# EAGLE design TicTacToe (EAGLE 9.6.2)

## Sheet 1 of 3
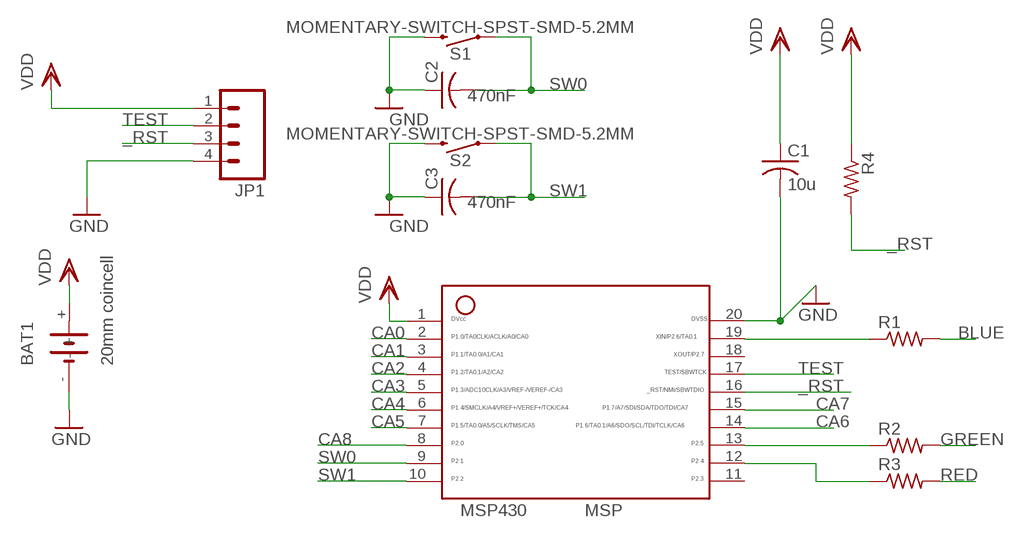
[diagram p0: schematic, sheet 1]

### Parts
BAT1  20mm coincell  1060TR  [BAT_1060TR]
C1  10u  C-USC1206  [C1206]
C2  470nF  C-USC0805  [C0805]
C3  470nF  C-USC0805  [C0805]
JP1  M04LOCK  [1X04_LOCK]
MSP430  MSP  MSP430  [20_PIN]
R1  R-US_R0805  [R0805]
R2  R-US_R0805  [R0805]
R3  R-US_R0805  [R0805]
R4  R-US_R0805  [R0805]
S1  MOMENTARY-SWITCH-SPST-SMD-5.2MM  [TACTILE_SWITCH_SMD_5.2MM]
S2  MOMENTARY-SWITCH-SPST-SMD-5.2MM  [TACTILE_SWITCH_SMD_5.2MM]

### Nets
_RST: JP1.3 MSP430.16 R4.2
BLUE: R1.2 ; also sheet 2
CA0: MSP430.2 ; also sheet 2
CA1: MSP430.3 ; also sheet 2
CA2: MSP430.4 ; also sheet 2
CA3: MSP430.5 ; also sheet 2
CA4: MSP430.6 ; also sheet 2
CA5: MSP430.7 ; also sheet 2
CA6: MSP430.14 ; also sheet 2
CA7: MSP430.15 ; also sheet 2
CA8: MSP430.8 ; also sheet 2
CB0: MSP430.19 R1.1
GND: BAT1.- C1.2 C2.1 C3.1 JP1.4 MSP430.20 S1.3 S2.3
GREEN: R2.2 ; also sheet 2
N$1: MSP430.12 R3.1
N$2: MSP430.13 R2.1
RED: R3.2 ; also sheet 2
SW0: C2.2 MSP430.9 S1.1
SW1: C3.2 MSP430.10 S2.1
TEST: JP1.2 MSP430.17
VDD: BAT1.+ C1.1 JP1.1 MSP430.1 R4.1
Unconnected: MSP430.11 MSP430.18

## Sheet 2 of 3
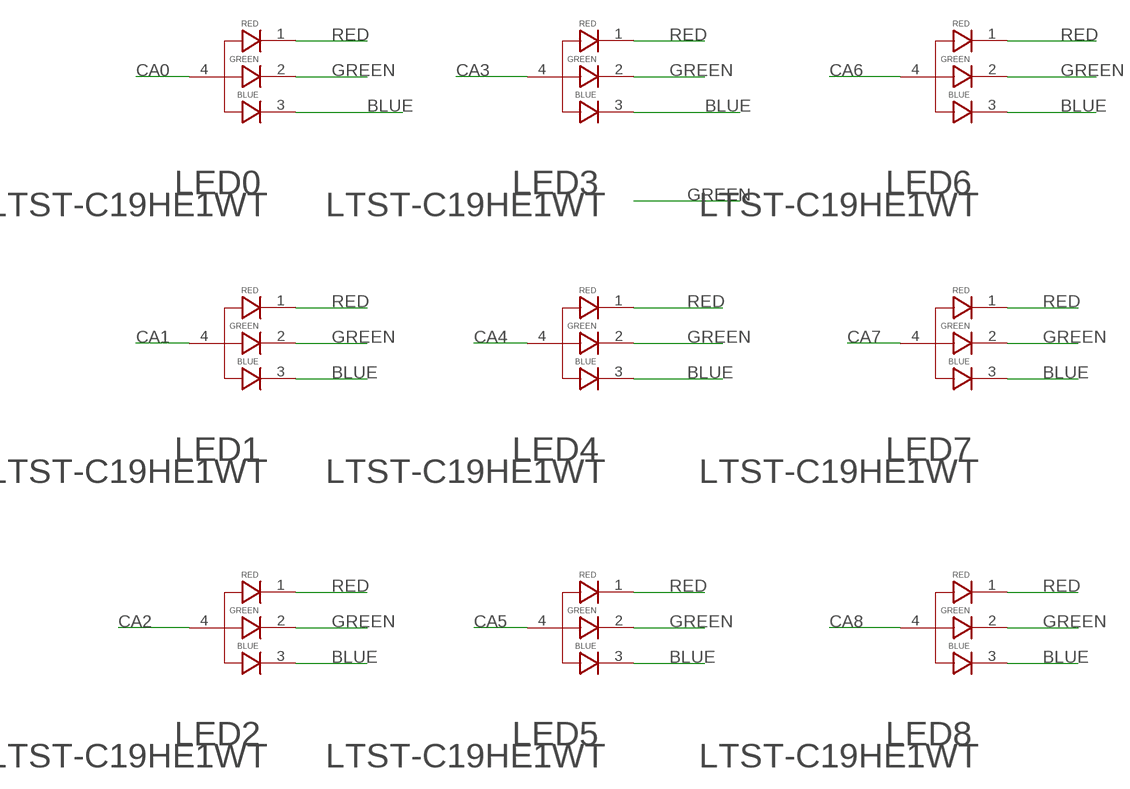
[diagram p1: schematic, sheet 2]

### Parts
LED0  LTST-C19HE1WT  [LED_LTST-C19HE1WT]
LED1  LTST-C19HE1WT  [LED_LTST-C19HE1WT]
LED2  LTST-C19HE1WT  [LED_LTST-C19HE1WT]
LED3  LTST-C19HE1WT  [LED_LTST-C19HE1WT]
LED4  LTST-C19HE1WT  [LED_LTST-C19HE1WT]
LED5  LTST-C19HE1WT  [LED_LTST-C19HE1WT]
LED6  LTST-C19HE1WT  [LED_LTST-C19HE1WT]
LED7  LTST-C19HE1WT  [LED_LTST-C19HE1WT]
LED8  LTST-C19HE1WT  [LED_LTST-C19HE1WT]

### Nets
BLUE: LED0.3 LED1.3 LED2.3 LED3.3 LED4.3 LED5.3 LED6.3 LED7.3 LED8.3 ; also sheet 1
CA0: LED0.4 ; also sheet 1
CA1: LED1.4 ; also sheet 1
CA2: LED2.4 ; also sheet 1
CA3: LED3.4 ; also sheet 1
CA4: LED4.4 ; also sheet 1
CA5: LED5.4 ; also sheet 1
CA6: LED6.4 ; also sheet 1
CA7: LED7.4 ; also sheet 1
CA8: LED8.4 ; also sheet 1
GREEN: LED0.2 LED1.2 LED2.2 LED3.2 LED4.2 LED5.2 LED6.2 LED7.2 LED8.2 ; also sheet 1
RED: LED0.1 LED1.1 LED2.1 LED3.1 LED4.1 LED5.1 LED6.1 LED7.1 LED8.1 ; also sheet 1

## Sheet 3 of 3

## Library data of the parts
BAT1 = 1060TR:1060TR: Low Profile Surface Mount CR2032 Coin Cell Battery Holder; DESCRIPTION: Battery Holder (Open) Coin, 20.0mm 1 Cell SMD (SMT) Tab; DIGI-KEY_PART_NUMBER: 36-1060CT-ND; MF: Keystone; MP: 1060TR; PACKAGE: None; PURCHASE-URL: https://pricing.snapeda.com/search/part/1060TR/?ref=eda
C1-C3 = rcl:C-US: CAPACITOR, American symbol; SPICEPREFIX: C
JP1 = Pendant:M04: Header 4 Standard 4-pin 0.1" header. Use with straight break away headers (SKU : PRT-00116), right angle break away headers (PRT-00553), swiss pins (PRT-00743), machine pins (PRT-00117), and female headers (PRT-00115). Molex polarized connector foot print use with SKU : PRT-08231 with associated crimp pins and housings.
LED0 LED1-LED8 = LTST-C19HE1WT:LTST-C19HE1WT: Red, Green, Blue (RGB) 624nm Red, 525nm Green, 470nm Blue LED Indication - Discrete 2.1V Red, 3.35V Green, 3.35V Blue 0606 (1616 Metric); DESCRIPTION: Red, Green, Blue (RGB) 624nm Red, 525nm Green, 470nm Blue LED Indication - Discrete 2.1V Red, 3.35V Green, 3.35V Blue 0606 (1616 Metric); DIGI-KEY_PART_NUMBER: 160-2162-1-ND; MF: Lite-On Inc.; MP: LTST-C19HE1WT; PACKAGE: 0606 Lite-On; PURCHASE-URL: https://pricing.snapeda.com/search/part/LTST-C19HE1WT/?ref=eda
MSP430 = RatDBS:MSP430: MSP430 20 pins
R1-R4 = rcl:R-US_: RESISTOR, American symbol; SPICEPREFIX: R
S1 S2 = SparkFun-Switches-Modified:MOMENTARY-SWITCH-SPST: Momentary Switch (Pushbutton) - SPST Normally-open (NO) SPST momentary switches (buttons, pushbuttons). Variants PTH-12MM - 12mm square, through-hole Momentary Pushbutton Switch - 12mm Square <https://www.sparkfun.com/products/9190> (COM-09190) PTH-6.0MM, PTH-6.0MM-KIT - 6.0mm square, through-hole Mini Pushbutton Switch <https://www.sparkfun.com/products/97> (COM-00097) KIT package intended for soldering kit's - only one side of pads' copper is exposed. PTH-RIGHT-ANGLE-KIT - Right-angle, through-hole Right Angle Tactile Button <https://www.sparkfun.com/products/10791> - Used on SparkFun BigTime Watch Kit <https://www.sparkfun.com/products/11734> SMD-12MM - 12mm square, surface-mount Tactile Button - SMD (12mm) <https://www.sparkfun.com/products/12993> (COM-12993) Used on SparkFun PicoBoard <https://www.sparkfun.com/products/11888> SMD-4.5MM - 4.5mm Square Trackball Switch Used on SparkFun Blackberry Trackballer Breakout <https://www.sparkfun.com/products/13169> SMD-4.6MMX2.8MM - 4.60mm x 2.80mm, surface mount Used on SparkFun SAMD21 Mini Breakout <https://www.sparkfun.com/products/13664> SMD-5.2MM, SMD-5.2-REDUNDANT - 5.2mm square, surface-mount Mini Pushbutton Switch - SMD <https://www.sparkfun.com/products/8720> (COM-08720) Used on Arduino Pro Mini <https://www.sparkfun.com/products/11114> REDUNDANT package connects both switch circuits together SMD-6.0X3.5MM - 6.0 x 3.5mm, surface mount Momentary Reset Switch SMD <https://www.sparkfun.com/products/8229> (COM-08229) SMD-6.2MM-TALL - 6.2mm square, surface mount Tactile Button - SMD (6mm) <https://www.sparkfun.com/products/12992> Used on SparkFun Digital Sandbox <https://www.sparkfun.com/products/12651> SMD-RIGHT-ANGLE - Right-angle, surface mount Used on SparkFun Block for Intel® Edison - Arduino <https://www.sparkfun.com/products/13036>; PROD_ID: SWCH-08247; SF_SKU: COM-08720

## Board
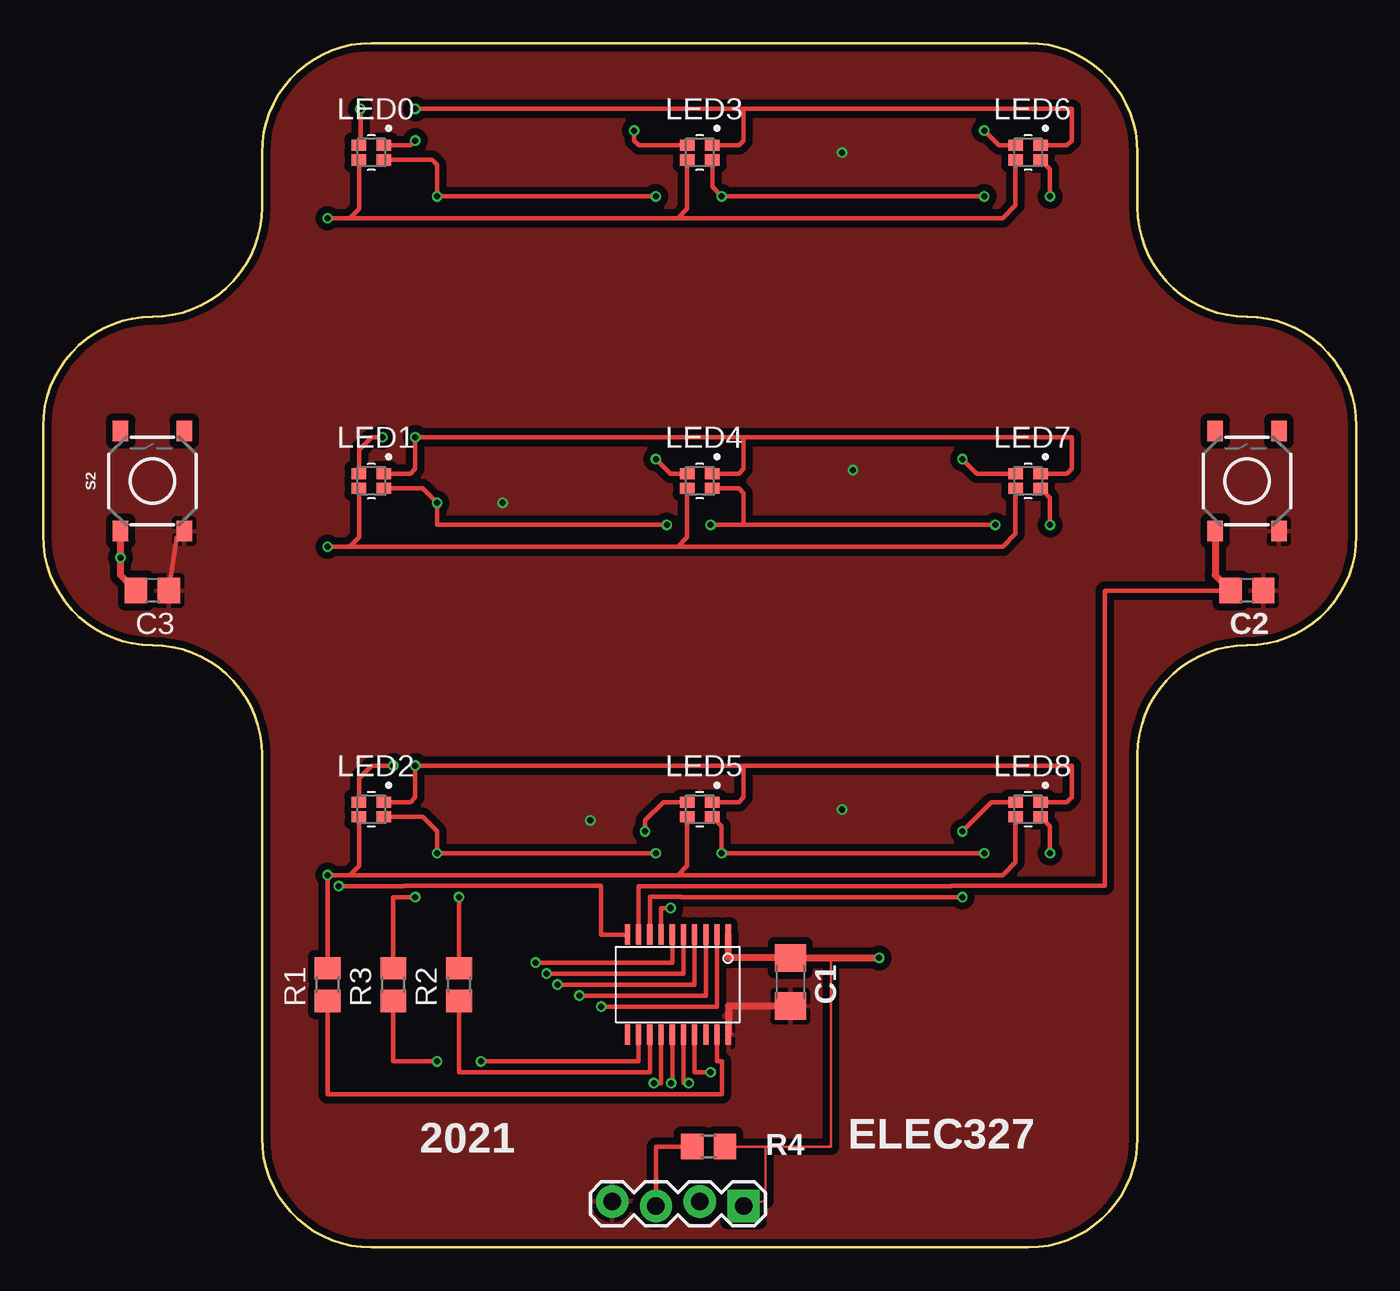
[diagram p2: board, top side]
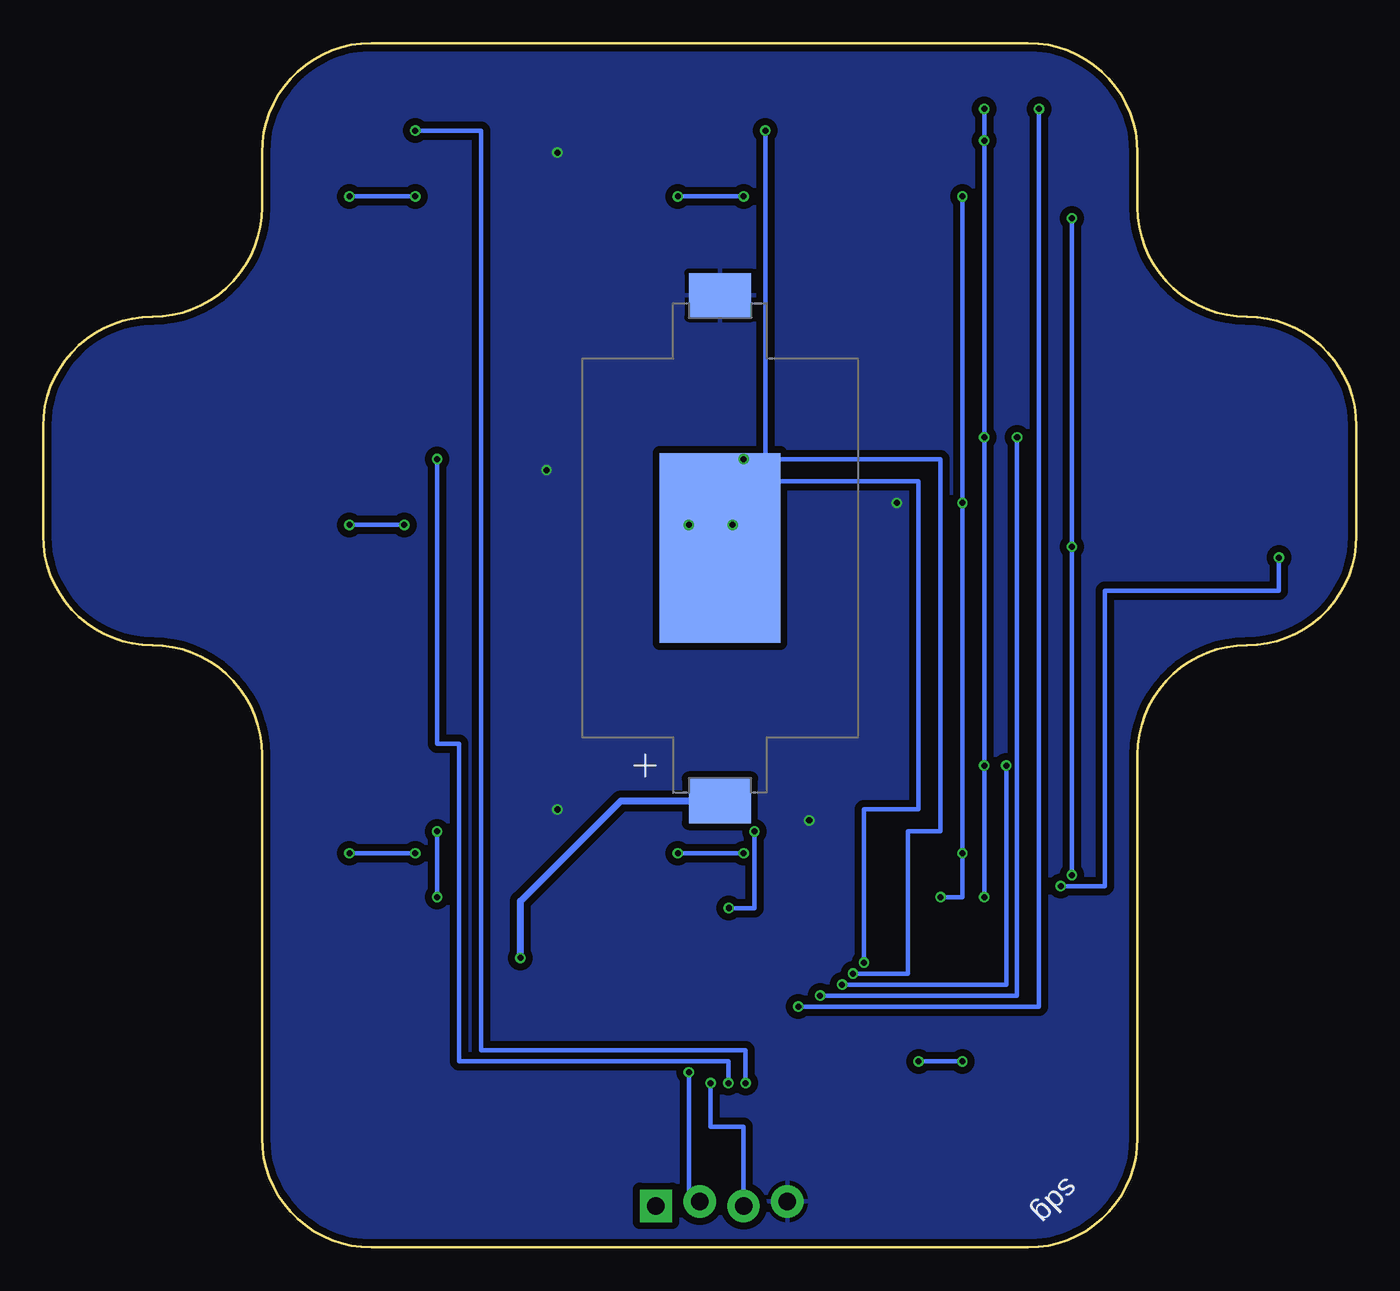
[diagram p3: board, bottom side, seen from below]

Size 76.2 x 69.85 mm. Coordinates in mm from the lower left corner, seen from the top.
Outline: 57.15,0 19.05,0 arc-90 12.7,6.35 12.7,28.57 arc90 6.35,34.93 arc-90 0,41.27 0,47.62 arc-90 6.35,53.98 arc90 12.7,60.33 12.7,63.5 arc-90 19.05,69.85 57.15,69.85 arc-90 63.5,63.5 63.5,60.33 arc90 69.85,53.98 arc-90 76.2,47.62 76.2,41.27 arc-90 69.85,34.93 arc90 63.5,28.57 63.5,6.35 arc-90 57.15,0
Copper layers (1*16): Top 0.035559375mm / dielectric 1.6mm / Bottom 0.035559375mm
Design rules "oshpark-2layer": minimum track width 6mil, minimum drill 10mil, track to track 6mil, track to pad 6mil, pad to pad 6mil, via to via 6mil, smd to smd 6mil, copper to edge 15mil, drill to drill 6mil, minimum pad ring 5mil, minimum via ring 5mil, stop-mask expansion 2.5mil, vias tented up to drill 0mil, thermal gap 10mil

### Footprints (pad centres in the part's own frame; a part is rotated, then mirrored left to right if it is on the bottom)
BAT_1060TR = smd 2.591 x 3.607: + 30.609,1.81; - 1.297,1.81 | smd 10.998 x 7.01: OPT_ADHESIVE 15.952,1.811
C1206 = smd 1.6 x 1.8: 1 -1.4,0; 2 1.4,0
C0805 = smd 1.3 x 1.5: 1 -0.95,0; 2 0.95,0
1X04_LOCK = drill 1.016 pad 1.88 square: 1 0,0.127 | drill 1.016 pad 1.88: 2 2.54,-0.127; 3 5.08,0.127; 4 7.62,-0.127
LED_LTST-C19HE1WT = smd 0.65 x 0.85: 1 -0.425,0.725; 2 0.425,0.725; 3 0.425,-0.725; 4 -0.425,-0.725
20_PIN = smd 0.3 x 1.2: 1 -2.925,-2.9; 2 -2.275,-2.9; 3 -1.625,-2.9; 4 -0.975,-2.9; 5 -0.325,-2.9; 6 0.325,-2.9; 7 0.975,-2.9; 8 1.625,-2.9; 9 2.275,-2.9; 10 2.925,-2.9; 11 2.925,2.9; 12 2.275,2.9; 13 1.625,2.9; 14 0.975,2.9; 15 0.325,2.9; 16 -0.325,2.9; 17 -0.975,2.9; 18 -1.625,2.9; 19 -2.275,2.9; 20 -2.925,2.9
R0805 = smd 1.3 x 1.5: 1 -0.95,0; 2 0.95,0
TACTILE_SWITCH_SMD_5.2MM = smd 1.2 x 0.9: 1 -2.9,1.85; 2 2.9,1.85; 3 -2.9,-1.85; 4 2.9,-1.85

### Placement (x,y rotation side)
BAT1  38.73,56.52 270 bottom
C1  43.35,15.39 270 top
C2  69.85,38.1 180 top
C3  6.35,38.1 180 top
JP1  40.64,2.54 180 top
LED0  19.05,63.5 270 top
LED1  19.05,44.45 270 top
LED2  19.05,25.4 270 top
LED3  38.1,63.5 270 top
LED4  38.1,44.45 270 top
LED5  38.1,25.4 270 top
LED6  57.15,63.5 270 top
LED7  57.15,44.45 270 top
LED8  57.15,25.4 270 top
MSP430  36.83,15.24 180 top
R1  16.51,15.24 90 top
R2  24.13,15.24 90 top
R3  20.32,15.24 90 top
R4  38.61,5.85 180 top
S1  69.85,44.45 90 top
S2  6.35,44.45 90 top

### Tracks (layer width: path | path; a pad name or v marks a point on that pad's centre or on a via)
_RST  (via drill 0.35)
  Top 0.254: MSP430.16 37.16,9.52 v37.47,9.52 | JP1.3 35.56,5.85 R4.2
  Bottom 0.254: v37.47,9.52 37.47,6.99 35.56,6.99 JP1.3
BLUE  (via drill 0.35)
  Top 0.254: v16.51,59.69 17.78,59.69 | v16.51,40.64 17.78,40.64 | 17.78,21.59 v16.51,21.59 R1.2 | 36.83,40.64 55.68,40.64 56.42,41.39 LED7.3 | 36.83,40.64 17.78,40.64 | 36.83,59.69 55.68,59.69 56.42,60.44 LED6.3 | 17.78,59.69 36.83,59.69 | 36.83,21.59 17.78,21.59 | 36.83,21.59 55.68,21.59 56.42,22.34 LED8.3 | LED5.3 37.38,22.14 36.83,21.59 | LED2.3 18.32,22.14 17.78,21.59 | LED1.3 18.32,41.19 17.78,40.64 | LED4.3 37.38,41.19 36.83,40.64 | LED3.3 37.38,60.23 36.83,59.69 | LED0.3 18.32,60.23 17.78,59.69
  Bottom 0.254: v16.51,59.69 v16.51,40.64 v16.51,21.59
CA0  (via drill 0.35)
  Top 0.254: MSP430.2 39.1,13.97 v32.38,13.97 | v18.41,66.04 18.41,64.02 LED0.4
  Bottom 0.254: v18.41,66.04 18.41,49.54 18.43,49.54 18.43,13.97 v32.38,13.97
CA1  (via drill 0.35)
  Top 0.254: MSP430.3 38.45,14.61 v31.11,14.61 | LED1.4 18.32,46.27 19.05,46.99 v19.68,46.99
  Bottom 0.254: v31.11,14.61 19.68,14.61 v19.68,46.99
CA2  (via drill 0.35)
  Top 0.254: MSP430.4 37.8,15.24 v29.84,15.24 | LED2.4 18.32,27.21 19.05,27.94 v20.32,27.94
  Bottom 0.254: v29.84,15.24 20.32,15.24 v20.32,27.94
CA3  (via drill 0.35)
  Top 0.254: v34.29,64.77 34.29,64.2 34.56,63.93 LED3.4 | MSP430.5 37.16,15.88 v29.21,15.88
  Bottom 0.254: v34.29,64.77 34.29,45.72 24.13,45.72 24.13,24.13 26.04,24.13 26.04,15.88 v29.21,15.88
CA4  (via drill 0.35)
  Top 0.254: MSP430.6 36.51,16.52 v28.57,16.52 | v35.56,45.72 36.41,44.88 LED4.4
  Bottom 0.254: v35.56,45.72 35.56,44.45 25.4,44.45 25.4,25.4 28.57,25.4 v28.57,16.52
CA5  (via drill 0.35)
  Top 0.254: MSP430.7 35.85,19.69 v36.41,19.69 | LED5.4 35.98,25.82 34.92,24.77 v34.92,24.13
  Bottom 0.254: v36.41,19.69 34.91,19.69 v34.91,24.12 v34.92,24.13
CA6  (via drill 0.35)
  Top 0.254: MSP430.14 35.85,9.52 v35.44,9.52 | v54.61,64.77 55.45,63.93 LED6.4
  Bottom 0.254: v35.44,9.52 35.44,11.43 50.8,11.43 50.8,64.77 v54.61,64.77
CA7  (via drill 0.35)
  Top 0.254: MSP430.15 36.51,9.52 v36.44,9.52 | v53.34,45.72 54.19,44.88 LED7.4
  Bottom 0.254: v36.44,9.52 36.44,10.8 52.07,10.8 52.07,29.21 53.34,29.21 v53.34,45.72
CA8  (via drill 0.35)
  Top 0.254: MSP430.8 35.2,20.33 37.05,20.33 37.05,20.32 v53.34,20.32 | LED8.4 55.03,25.82 v53.34,24.13
  Bottom 0.254: v53.34,24.13 v53.33,24.12 v53.33,20.33 v53.34,20.32
CB0
  Top 0.254: R1.1 16.51,8.89 39.38,8.89 39.38,10.8 39.1,10.8 MSP430.19
GND  (via drill 0.35)
  Top 0.254: C3.1 7.75,41.2 S2.3
  Top 0.406: C1.2 39.76,13.99 MSP430.20
  other vias: 46.99,45.09 31.75,24.77 46.35,25.4 26.67,43.18 46.35,63.5
  pour Top (isolate 0.406): 0,-2.54 76.2,-2.54 76.2,69.85 0,69.85
  pour Bottom (isolate 0.406): 0,-2.54 76.2,-2.54 76.2,69.85 0,69.85
GREEN  (via drill 0.35)
  Top 0.254: v35.56,60.96 v22.86,60.96 22.86,62.8 22.59,63.07 LED0.2 | v54.61,60.96 v39.37,60.96 38.83,61.51 LED3.2 | v55.24,41.91 40.64,41.91 | 40.64,41.91 40.64,43.75 40.37,44.02 LED4.2 | 40.64,41.91 v38.73,41.91 | v36.2,41.91 22.86,41.91 v22.86,43.18 22.02,44.02 LED1.2 | v35.56,22.86 v22.86,22.86 22.86,24.13 22.02,24.98 LED2.2 | v54.61,22.86 v39.37,22.86 39.37,24.43 LED5.2 | R2.2 v24.13,20.32 | LED8.2 58.42,24.43 v58.42,22.86 | LED7.2 58.42,43.48 v58.42,41.91 | LED6.2 58.42,62.53 v58.42,60.96
  Bottom 0.254: v22.86,60.96 v22.86,43.18 v22.86,22.86 22.86,20.32 v24.13,20.32 | v35.56,60.96 v39.37,60.96 | v54.61,60.96 v58.42,60.96 | v58.42,41.91 v55.24,41.91 | v38.73,41.91 v36.2,41.91 | v39.37,22.86 v35.56,22.86 | v58.42,22.86 v54.61,22.86
N$1  (via drill 0.35)
  Top 0.254: R3.1 20.32,10.8 v22.86,10.8 | MSP430.12 34.55,10.8 v25.4,10.8
  Bottom 0.254: v22.86,10.8 v25.4,10.8
N$2
  Top 0.254: R2.1 24.13,10.16 35.2,10.16 MSP430.13
RED  (via drill 0.35)
  Top 0.254: v21.59,66.04 40.64,66.04 | 40.64,66.04 40.64,64.2 40.37,63.93 LED3.1 | 40.64,66.04 59.69,66.04 59.69,64.2 59.41,63.93 LED6.1 | 40.64,46.99 v21.59,46.99 21.59,45.15 21.32,44.88 LED1.1 | 40.64,46.99 40.64,45.15 40.37,44.88 LED4.1 | 40.64,46.99 59.69,46.99 59.69,45.15 59.41,44.88 LED7.1 | 40.64,27.94 59.69,27.94 59.69,26.1 59.41,25.82 LED8.1 | 40.64,27.94 40.64,26.1 40.37,25.82 LED5.1 | 40.64,27.94 v21.59,27.94 21.59,26.1 21.32,25.82 LED2.1 | v21.59,20.32 20.32,20.32 R3.2 | LED0.1 21.32,63.93 v21.59,64.2
  Bottom 0.254: v21.59,66.04 v21.59,64.2 v21.59,46.99 v21.59,27.94 v21.59,20.32
SW0
  Top 0.254: MSP430.9 34.55,20.96 52.7,20.96 61.59,20.96 61.59,38.1 C2.2
  Top 0.406: S1.1 68,39 C2.2
SW1  (via drill 0.35)
  Top 0.254: MSP430.10 32.38,18.14 32.38,20.96 20.95,20.96 v17.16,20.96
  Top 0.406: C3.2 4.5,39 v4.5,40.01 S2.1
  Bottom 0.254: 6.35,38.1 14.61,38.1 14.61,20.95 17.16,20.95 v17.16,20.96 | 6.35,38.1 5.99,38.1 | 6.35,38.1 4.5,38.1 v4.5,40.01
TEST  (via drill 0.35)
  Top 0.254: MSP430.17 37.8,10.16 v38.73,10.16
  Bottom 0.254: JP1.2 38.73,2.67 v38.73,10.16
VDD  (via drill 0.35)
  Top 0.152: C1.1 45.72,16.79 45.72,5.85 41.91,5.85 | R4.1 41.91,5.85 | JP1.1 41.91,2.7 41.91,5.85
  Top 0.406: MSP430.1 39.76,16.79 C1.1 v48.5,16.79
  Bottom 0.406: v48.5,16.79 48.5,20.08 42.67,25.91 BAT1.+

### Text on the board
tPlace: 2021 | ELEC327
bPlace: sdg